# Altium schematic sheet DDR.SchDoc
size C; DocumentNumber: 5; SheetNumber: 5; SheetTotal: 8
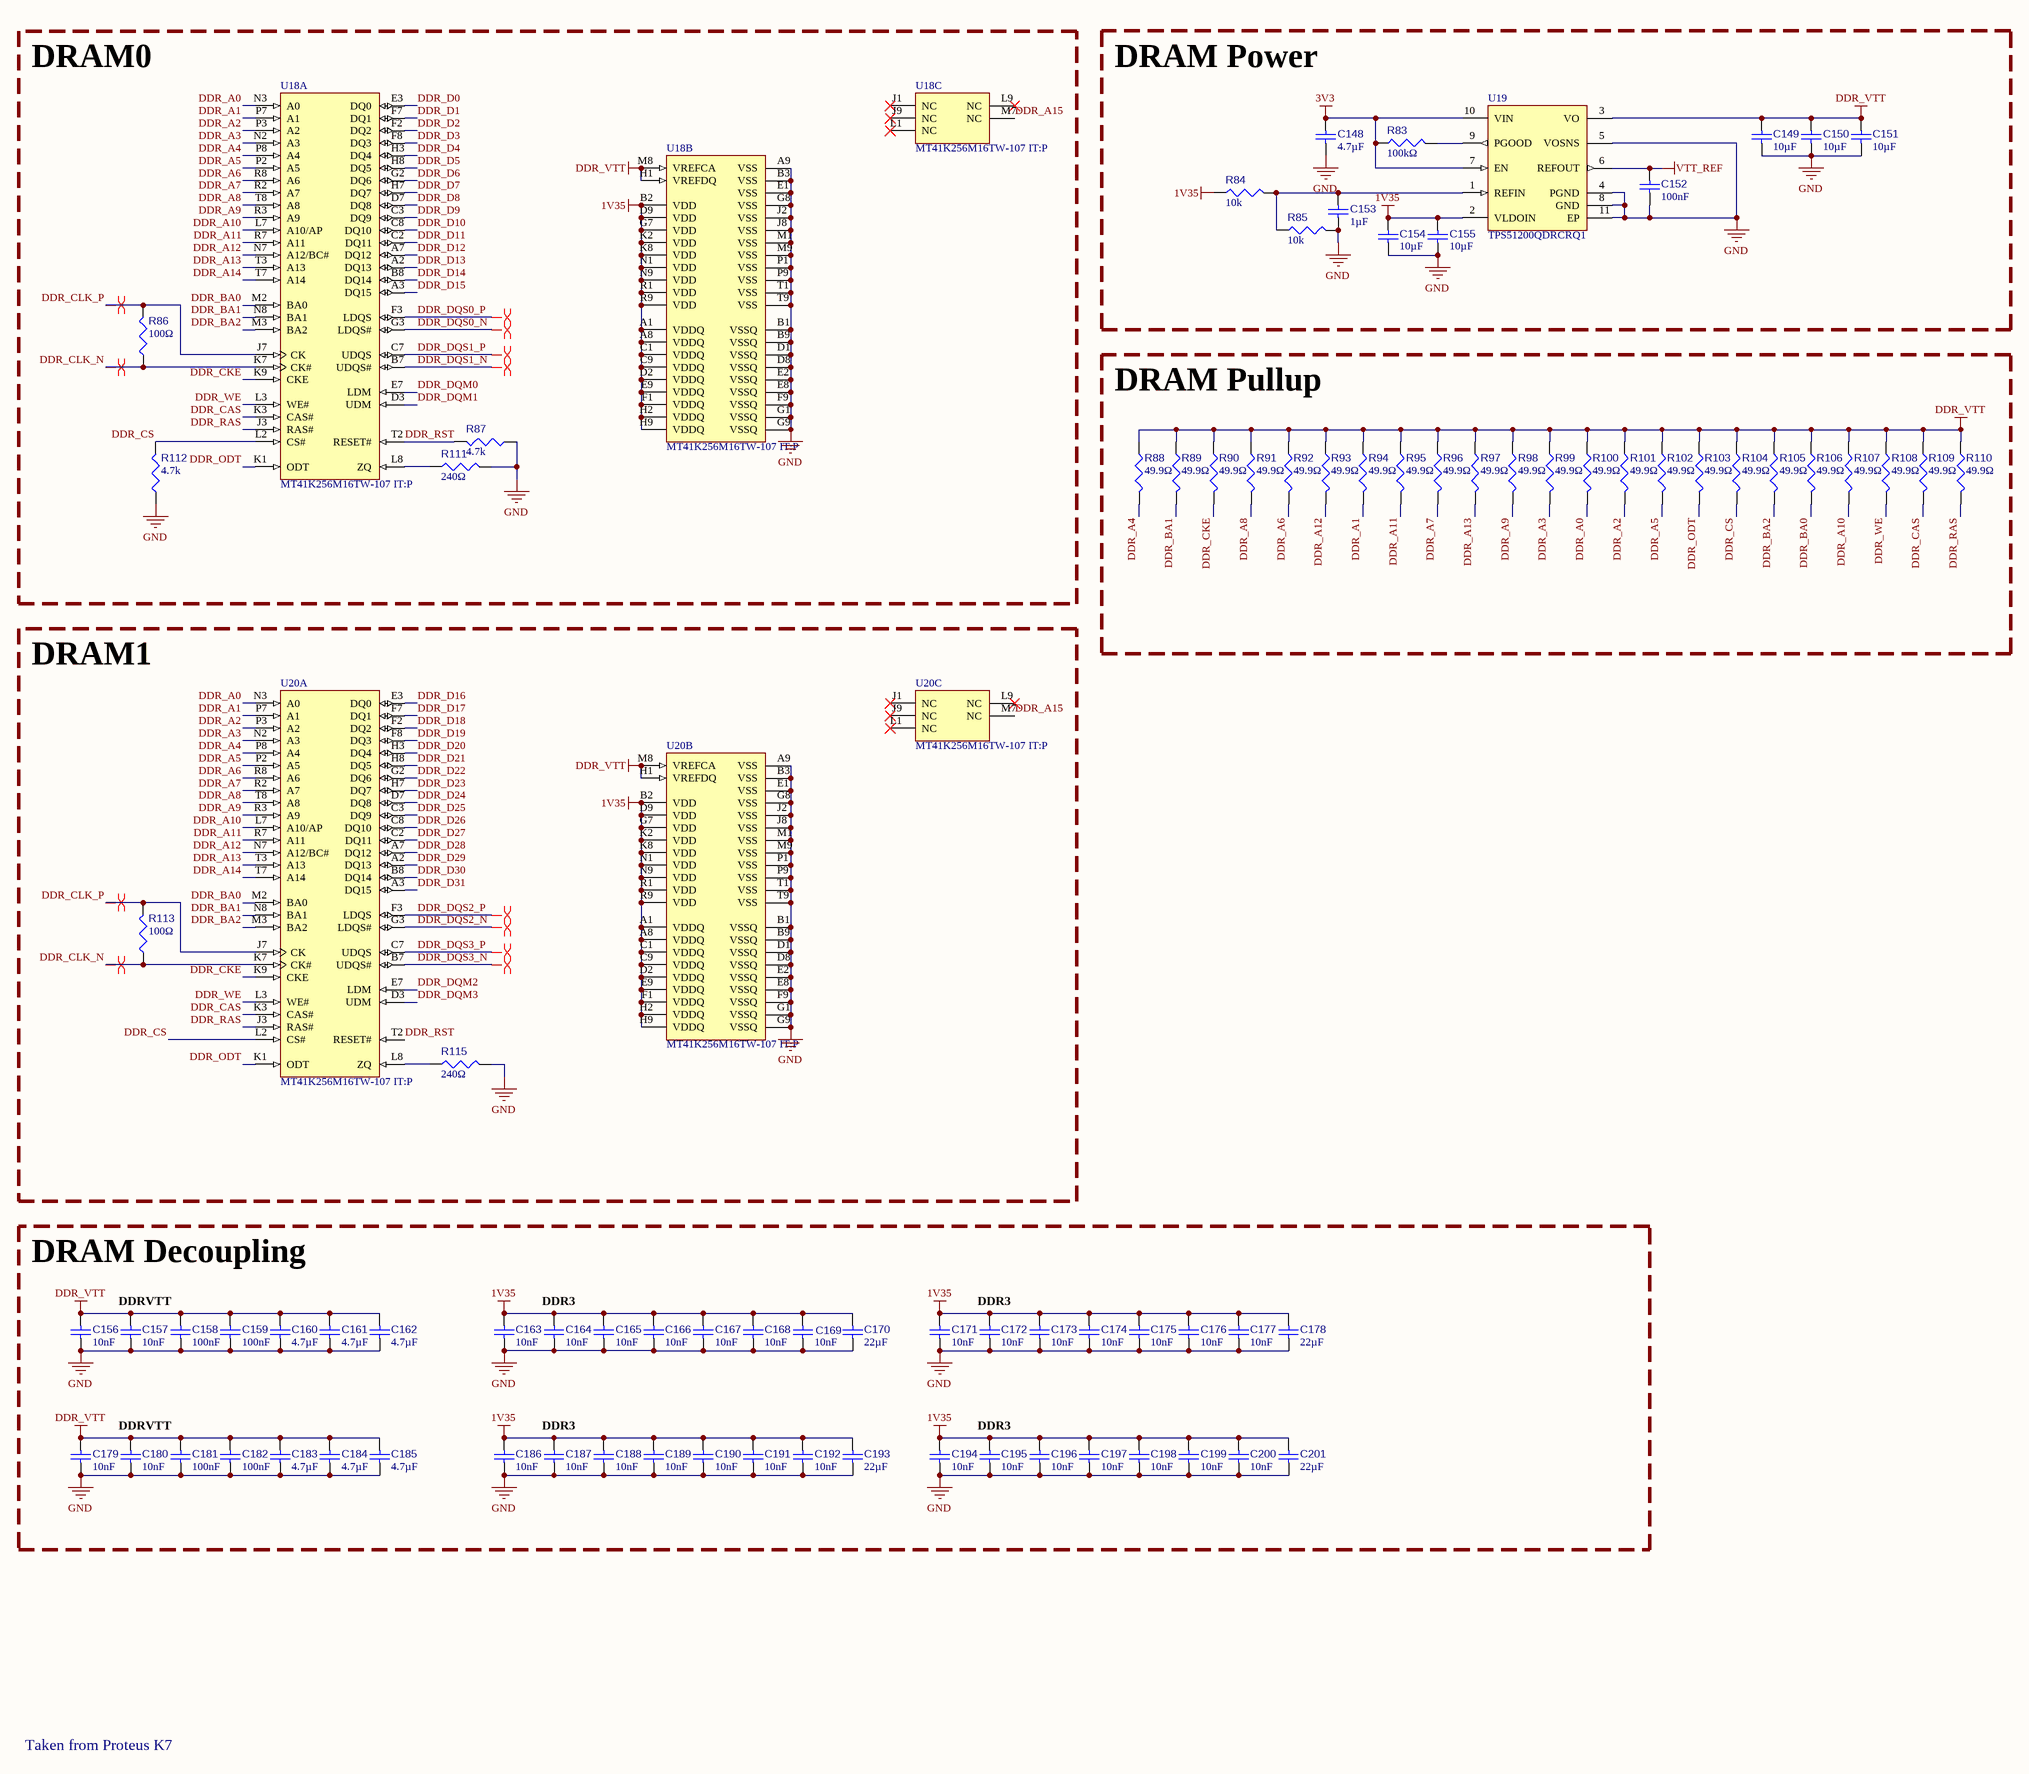
[diagram p0: DDR.SchDoc]

## Parts
C148  value 4.7µF  [CAP-0402-MFG]  (hidden comment: GRM155R61E475ME15D)
C149  value 10µF  [CAP-0603-MFG]  (hidden comment: GRT188R61C106KE13J)
C150  value 10µF  [CAP-0603-MFG]  (hidden comment: GRT188R61C106KE13J)
C151  value 10µF  [CAP-0603-MFG]  (hidden comment: GRT188R61C106KE13J)
C152  value 100nF  [CAP-0402-MFG]  (hidden comment: CL05B104KO5VPNC)
C153  value 1µF  [CAP-0402-MFG]  (hidden comment: GRT155C81C105KE13J)
C154  value 10µF  [CAP-0603-MFG]  (hidden comment: GRT188R61C106KE13J)
C155  value 10µF  [CAP-0603-MFG]  (hidden comment: GRT188R61C106KE13J)
C156  value 10nF  [CAP-0402-MFG]  (hidden comment: AC0402KRX7R7BB103)
C157  value 10nF  [CAP-0402-MFG]  (hidden comment: AC0402KRX7R7BB103)
C158  value 100nF  [CAP-0402-MFG]  (hidden comment: CL05B104KO5VPNC)
C159  value 100nF  [CAP-0402-MFG]  (hidden comment: CL05B104KO5VPNC)
C160  value 4.7µF  [CAP-0402-MFG]  (hidden comment: GRM155R61E475ME15D)
C161  value 4.7µF  [CAP-0402-MFG]  (hidden comment: GRM155R61E475ME15D)
C162  value 4.7µF  [CAP-0402-MFG]  (hidden comment: GRM155R61E475ME15D)
C163  value 10nF  [CAP-0402-MFG]  (hidden comment: AC0402KRX7R7BB103)
C164  value 10nF  [CAP-0402-MFG]  (hidden comment: AC0402KRX7R7BB103)
C165  value 10nF  [CAP-0402-MFG]  (hidden comment: AC0402KRX7R7BB103)
C166  value 10nF  [CAP-0402-MFG]  (hidden comment: AC0402KRX7R7BB103)
C167  value 10nF  [CAP-0402-MFG]  (hidden comment: AC0402KRX7R7BB103)
C168  value 10nF  [CAP-0402-MFG]  (hidden comment: AC0402KRX7R7BB103)
C169  value 10nF  [CAP-0402-MFG]  (hidden comment: AC0402KRX7R7BB103)
C170  value 22µF  [CAP-0402-MFG]  (hidden comment: GRM158R61A226ME15D)
C171  value 10nF  [CAP-0402-MFG]  (hidden comment: AC0402KRX7R7BB103)
C172  value 10nF  [CAP-0402-MFG]  (hidden comment: AC0402KRX7R7BB103)
C173  value 10nF  [CAP-0402-MFG]  (hidden comment: AC0402KRX7R7BB103)
C174  value 10nF  [CAP-0402-MFG]  (hidden comment: AC0402KRX7R7BB103)
C175  value 10nF  [CAP-0402-MFG]  (hidden comment: AC0402KRX7R7BB103)
C176  value 10nF  [CAP-0402-MFG]  (hidden comment: AC0402KRX7R7BB103)
C177  value 10nF  [CAP-0402-MFG]  (hidden comment: AC0402KRX7R7BB103)
C178  value 22µF  [CAP-0402-MFG]  (hidden comment: GRM158R61A226ME15D)
C179  value 10nF  [CAP-0402-MFG]  (hidden comment: AC0402KRX7R7BB103)
C180  value 10nF  [CAP-0402-MFG]  (hidden comment: AC0402KRX7R7BB103)
C181  value 100nF  [CAP-0402-MFG]  (hidden comment: CL05B104KO5VPNC)
C182  value 100nF  [CAP-0402-MFG]  (hidden comment: CL05B104KO5VPNC)
C183  value 4.7µF  [CAP-0402-MFG]  (hidden comment: GRM155R61E475ME15D)
C184  value 4.7µF  [CAP-0402-MFG]  (hidden comment: GRM155R61E475ME15D)
C185  value 4.7µF  [CAP-0402-MFG]  (hidden comment: GRM155R61E475ME15D)
C186  value 10nF  [CAP-0402-MFG]  (hidden comment: AC0402KRX7R7BB103)
C187  value 10nF  [CAP-0402-MFG]  (hidden comment: AC0402KRX7R7BB103)
C188  value 10nF  [CAP-0402-MFG]  (hidden comment: AC0402KRX7R7BB103)
C189  value 10nF  [CAP-0402-MFG]  (hidden comment: AC0402KRX7R7BB103)
C190  value 10nF  [CAP-0402-MFG]  (hidden comment: AC0402KRX7R7BB103)
C191  value 10nF  [CAP-0402-MFG]  (hidden comment: AC0402KRX7R7BB103)
C192  value 10nF  [CAP-0402-MFG]  (hidden comment: AC0402KRX7R7BB103)
C193  value 22µF  [CAP-0402-MFG]  (hidden comment: GRM158R61A226ME15D)
C194  value 10nF  [CAP-0402-MFG]  (hidden comment: AC0402KRX7R7BB103)
C195  value 10nF  [CAP-0402-MFG]  (hidden comment: AC0402KRX7R7BB103)
C196  value 10nF  [CAP-0402-MFG]  (hidden comment: AC0402KRX7R7BB103)
C197  value 10nF  [CAP-0402-MFG]  (hidden comment: AC0402KRX7R7BB103)
C198  value 10nF  [CAP-0402-MFG]  (hidden comment: AC0402KRX7R7BB103)
C199  value 10nF  [CAP-0402-MFG]  (hidden comment: AC0402KRX7R7BB103)
C200  value 10nF  [CAP-0402-MFG]  (hidden comment: AC0402KRX7R7BB103)
C201  value 22µF  [CAP-0402-MFG]  (hidden comment: GRM158R61A226ME15D)
R83  value 100kΩ  [RES-0402]  (hidden comment: AC0402FR-07100KL)
R84  value 10k  [RES-0402]  (hidden comment: AC0402FR-0710KL)
R85  value 10k  [RES-0402]  (hidden comment: AC0402FR-0710KL)
R86  value 100Ω  [RES-0402]  (hidden comment: AC0402FR-07100RL)
R87  value 4.7k  [RES-0402]  (hidden comment: AC0402FR-074K7L)
R88  value 49.9Ω  [RES-0402]  (hidden comment: CRCW040249R9FKED)
R89  value 49.9Ω  [RES-0402]  (hidden comment: CRCW040249R9FKED)
R90  value 49.9Ω  [RES-0402]  (hidden comment: CRCW040249R9FKED)
R91  value 49.9Ω  [RES-0402]  (hidden comment: CRCW040249R9FKED)
R92  value 49.9Ω  [RES-0402]  (hidden comment: CRCW040249R9FKED)
R93  value 49.9Ω  [RES-0402]  (hidden comment: CRCW040249R9FKED)
R94  value 49.9Ω  [RES-0402]  (hidden comment: CRCW040249R9FKED)
R95  value 49.9Ω  [RES-0402]  (hidden comment: CRCW040249R9FKED)
R96  value 49.9Ω  [RES-0402]  (hidden comment: CRCW040249R9FKED)
R97  value 49.9Ω  [RES-0402]  (hidden comment: CRCW040249R9FKED)
R98  value 49.9Ω  [RES-0402]  (hidden comment: CRCW040249R9FKED)
R99  value 49.9Ω  [RES-0402]  (hidden comment: CRCW040249R9FKED)
R100  value 49.9Ω  [RES-0402]  (hidden comment: CRCW040249R9FKED)
R101  value 49.9Ω  [RES-0402]  (hidden comment: CRCW040249R9FKED)
R102  value 49.9Ω  [RES-0402]  (hidden comment: CRCW040249R9FKED)
R103  value 49.9Ω  [RES-0402]  (hidden comment: CRCW040249R9FKED)
R104  value 49.9Ω  [RES-0402]  (hidden comment: CRCW040249R9FKED)
R105  value 49.9Ω  [RES-0402]  (hidden comment: CRCW040249R9FKED)
R106  value 49.9Ω  [RES-0402]  (hidden comment: CRCW040249R9FKED)
R107  value 49.9Ω  [RES-0402]  (hidden comment: CRCW040249R9FKED)
R108  value 49.9Ω  [RES-0402]  (hidden comment: CRCW040249R9FKED)
R109  value 49.9Ω  [RES-0402]  (hidden comment: CRCW040249R9FKED)
R110  value 49.9Ω  [RES-0402]  (hidden comment: CRCW040249R9FKED)
R111  value 240Ω  [RES-0402]  (hidden comment: AC0402FR-07240RL)
R112  value 4.7k  [RES-0402]  (hidden comment: AC0402FR-074K7L)
R113  value 100Ω  [RES-0402]  (hidden comment: AC0402FR-07100RL)
R115  value 240Ω  [RES-0402]  (hidden comment: AC0402FR-07240RL)
U18  MT41K256M16TW-107 IT:P  [MICT-TW-96]  (parts A,B,C of 3)
U19  TPS51200QDRCRQ1  [FP-DRC0010J-MFG]
U20  MT41K256M16TW-107 IT:P  [MICT-TW-96]  (parts A,B,C of 3)

## Blocks framed on the sheet
DRAM0: R86 R87 R111 R112 U18
DRAM Power: C148-C155 R83-R85 U19
DRAM Pullup: R88-R110
DRAM1: R113 R115 U20
DRAM Decoupling: C156-C201

## Nets
1V35: C154.1 C155.1 C163.1 C164.1 C165.1 C166.1 C167.1 C168.2 C169.1 C170.1 C171.1 C172.2 C173.2 C174.2 C175.2 C176.2 C177.2 C178.1 C186.1 C187.2 C188.2 C189.2 C190.2 C191.2 C192.2 C193.1 C194.1 C195.2 C196.2 C197.2 C198.2 C199.2 C200.2 C201.1 R84.1 U18.A1(VDDQ) U18.A8(VDDQ) U18.B2(VDD) U18.C1(VDDQ) U18.C9(VDDQ) U18.D2(VDDQ) U18.D9(VDD) U18.E9(VDDQ) U18.F1(VDDQ) U18.G7(VDD) U18.H2(VDDQ) U18.H9(VDDQ) U18.K2(VDD) U18.K8(VDD) U18.N1(VDD) U18.N9(VDD) U18.R1(VDD) U18.R9(VDD) U19.2(VLDOIN) U20.A1(VDDQ) U20.A8(VDDQ) U20.B2(VDD) U20.C1(VDDQ) U20.C9(VDDQ) U20.D2(VDDQ) U20.D9(VDD) U20.E9(VDDQ) U20.F1(VDDQ) U20.G7(VDD) U20.H2(VDDQ) U20.H9(VDDQ) U20.K2(VDD) U20.K8(VDD) U20.N1(VDD) U20.N9(VDD) U20.R1(VDD) U20.R9(VDD)
3V3: C148.1 R83.1 U19.7(EN) U19.10(VIN)
DDR_VTT: C149.1 C150.1 C151.2 C156.1 C157.1 C158.2 C159.2 C160.1 C161.1 C162.2 C179.1 C180.1 C181.1 C182.1 C183.1 C184.1 C185.2 R88.1 R89.1 R90.1 R91.1 R92.1 R93.1 R94.1 R95.1 R96.1 R97.1 R98.1 R99.1 R100.1 R101.1 R102.1 R103.1 R104.1 R105.1 R106.1 R107.1 R108.1 R109.1 R110.1 U18.H1(VREFDQ) U18.M8(VREFCA) U19.3(VO) U20.H1(VREFDQ) U20.M8(VREFCA)
GND: C148.2 C149.2 C150.2 C151.1 C152.2 C153.1 C154.2 C155.2 C156.2 C157.2 C158.1 C159.1 C160.2 C161.2 C162.1 C163.2 C164.2 C165.2 C166.2 C167.2 C168.1 C169.2 C170.2 C171.2 C172.1 C173.1 C174.1 C175.1 C176.1 C177.1 C178.2 C179.2 C180.2 C181.2 C182.2 C183.2 C184.2 C185.1 C186.2 C187.1 C188.1 C189.1 C190.1 C191.1 C192.1 C193.2 C194.2 C195.1 C196.1 C197.1 C198.1 C199.1 C200.1 C201.2 R85.2 R87.1 R111.2 R112.1 R115.2 U18.A9(VSS) U18.B1(VSSQ) U18.B3(VSS) U18.B9(VSSQ) U18.D1(VSSQ) U18.D8(VSSQ) U18.E1(VSS) U18.E2(VSSQ) U18.E8(VSSQ) U18.F9(VSSQ) U18.G1(VSSQ) U18.G8(VSS) U18.G9(VSSQ) U18.J2(VSS) U18.J8(VSS) U18.M1(VSS) U18.M9(VSS) U18.P1(VSS) U18.P9(VSS) U18.T1(VSS) U18.T9(VSS) U19.4(PGND) U19.5(VOSNS) U19.8(GND) U19.11(EP) U20.A9(VSS) U20.B1(VSSQ) U20.B3(VSS) U20.B9(VSSQ) U20.D1(VSSQ) U20.D8(VSSQ) U20.E1(VSS) U20.E2(VSSQ) U20.E8(VSSQ) U20.F9(VSSQ) U20.G1(VSSQ) U20.G8(VSS) U20.G9(VSSQ) U20.J2(VSS) U20.J8(VSS) U20.M1(VSS) U20.M9(VSS) U20.P1(VSS) U20.P9(VSS) U20.T1(VSS) U20.T9(VSS)
VTT_REF: C152.1 U19.6(REFOUT)
DDR_A0: R100.2 U18.N3(A0) U20.N3(A0)
DDR_A1: R94.2 U18.P7(A1) U20.P7(A1)
DDR_A2: R101.2 U18.P3(A2) U20.P3(A2)
DDR_A3: R99.2 U18.N2(A3) U20.N2(A3)
DDR_A4: R88.2 U18.P8(A4) U20.P8(A4)
DDR_A5: R102.2 U18.P2(A5) U20.P2(A5)
DDR_A6: R92.2 U18.R8(A6) U20.R8(A6)
DDR_A7: R96.2 U18.R2(A7) U20.R2(A7)
DDR_A8: R91.2 U18.T8(A8) U20.T8(A8)
DDR_A9: R98.2 U18.R3(A9) U20.R3(A9)
DDR_A10: R107.2 U18.L7(A10/AP) U20.L7(A10/AP)
DDR_A11: R95.2 U18.R7(A11) U20.R7(A11)
DDR_A12: R93.2 U18.N7(A12/BC#) U20.N7(A12/BC#)
DDR_A13: R97.2 U18.T3(A13) U20.T3(A13)
DDR_A14: U18.T7(A14) U20.T7(A14)
DDR_A15: U18.M7(NC) U20.M7(NC)
DDR_BA0: R106.2 U18.M2(BA0) U20.M2(BA0)
DDR_BA1: R89.2 U18.N8(BA1) U20.N8(BA1)
DDR_BA2: R105.2 U18.M3(BA2) U20.M3(BA2)
DDR_CAS: R109.2 U18.K3(CAS#) U20.K3(CAS#)
DDR_CKE: R90.2 U18.K9(CKE) U20.K9(CKE)
DDR_CLK_N: R86.1 R113.1 U18.K7(CK#) U20.K7(CK#)
DDR_CLK_P: R86.2 R113.2 U18.J7(CK) U20.J7(CK)
DDR_CS: R104.2 R112.2 U18.L2(CS#) U20.L2(CS#)
DDR_D0: U18.E3(DQ0)
DDR_D1: U18.F7(DQ1)
DDR_D2: U18.F2(DQ2)
DDR_D3: U18.F8(DQ3)
DDR_D4: U18.H3(DQ4)
DDR_D5: U18.H8(DQ5)
DDR_D6: U18.G2(DQ6)
DDR_D7: U18.H7(DQ7)
DDR_D8: U18.D7(DQ8)
DDR_D9: U18.C3(DQ9)
DDR_D10: U18.C8(DQ10)
DDR_D11: U18.C2(DQ11)
DDR_D12: U18.A7(DQ12)
DDR_D13: U18.A2(DQ13)
DDR_D14: U18.B8(DQ14)
DDR_D15: U18.A3(DQ15)
DDR_D16: U20.E3(DQ0)
DDR_D17: U20.F7(DQ1)
DDR_D18: U20.F2(DQ2)
DDR_D19: U20.F8(DQ3)
DDR_D20: U20.H3(DQ4)
DDR_D21: U20.H8(DQ5)
DDR_D22: U20.G2(DQ6)
DDR_D23: U20.H7(DQ7)
DDR_D24: U20.D7(DQ8)
DDR_D25: U20.C3(DQ9)
DDR_D26: U20.C8(DQ10)
DDR_D27: U20.C2(DQ11)
DDR_D28: U20.A7(DQ12)
DDR_D29: U20.A2(DQ13)
DDR_D30: U20.B8(DQ14)
DDR_D31: U20.A3(DQ15)
DDR_DQM0: U18.E7(LDM)
DDR_DQM1: U18.D3(UDM)
DDR_DQM2: U20.E7(LDM)
DDR_DQM3: U20.D3(UDM)
DDR_DQS0_N: U18.G3(LDQS#)
DDR_DQS0_P: U18.F3(LDQS)
DDR_DQS1_N: U18.B7(UDQS#)
DDR_DQS1_P: U18.C7(UDQS)
DDR_DQS2_N: U20.G3(LDQS#)
DDR_DQS2_P: U20.F3(LDQS)
DDR_DQS3_N: U20.B7(UDQS#)
DDR_DQS3_P: U20.C7(UDQS)
DDR_ODT: R103.2 U18.K1(ODT) U20.K1(ODT)
DDR_RAS: R110.2 U18.J3(RAS#) U20.J3(RAS#)
DDR_RST: R87.2 U18.T2(RESET#) U20.T2(RESET#)
DDR_WE: R108.2 U18.L3(WE#) U20.L3(WE#)
NetC153_2: C153.2 R84.2 R85.1 U19.1(REFIN)
NetR83_2: R83.2 U19.9(PGOOD)
NetR111_1: R111.1 U18.L8(ZQ)
NetR115_1: R115.1 U20.L8(ZQ)

Not connected (* = marked no-connect by the designer): U18 J1(NC)* J9(NC)* L1(NC)* L9(NC)*; U20 J1(NC)* J9(NC)* L1(NC)* L9(NC)*

## Layout directives
differential pair: DDR_CLK_N, DDR_CLK_P, DDR_DQS0_N, DDR_DQS1_N, DDR_DQS1_P, DDR_DQS2_N, DDR_DQS3_N, DDR_DQS3_P
differential pair; differential pair class DDR: DDR_DQS0_P, DDR_DQS2_P

## Notes on the sheet
- (near C157) DDRVTT
- (near C164) DDR3
- (near C172) DDR3
- (near C180) DDRVTT
- (near C187) DDR3
- (near C195) DDR3
- Taken from Proteus K7

## Library data of the parts
C148 C160-C162 C183-C185 = CMP-104-000119-5: 0402-4.7u-20%-25V-X5R; Manufacturer Name: Murata; Temp Code: X5R; Tolerance: 20%; Capacitor Type: Ceramic; Voltage Rating: 25V; Pin Count: 2; Case/Package: 0402; Mounting Technology: Surface Mount; Source: Components - 11.02.26 - 17.26.SchLib; JLC PN: C2858031; Min Operating Temperature: -55°C; Max Operating Temperature: 85°C; Design Item ID: CMP-001-00116-4; Component Type: Standard; Info: 0402-4.7u-20%-25V-X5R; Pins: 2; Manufacturer Part Number: GRM155R61E475ME15D
C149-C151 C154 C155 = CMP-104-000103-5: 0603-10u-10%-16V-X5R-AECQ200; Manufacturer Name: Murata; Tolerance: 10%; Voltage Rating: 16V; Capacitor Type: Ceramic; Design Item ID: CMP-001-00130-1; Min Operating Temperature: -55°C; Source: Components - 11.02.26 - 17.26.SchLib; Info: 0603-10u-10%-16V-X5R-AECQ200; Mounting Technology: Surface Mount; Pin Count: 2; Pins: 2; Manufacturer Part Number: GRT188R61C106KE13J; Max Operating Temperature: 85°C; Component Type: Standard; Case/Package: 0603; JLC PN: C3888097
C152 C158 C159 C181 C182 = CMP-104-000086-6: 0402-100n-10%-16V-X7R-AECQ200; Manufacturer Name: Murata; Capacitor Type: Ceramic; Voltage Rating: 16V; Tolerance: 10%; Temp Code: X7R; Component Type: Standard; Min Operating Temperature: -55°C; Source: Components - 11.02.26 - 17.26.SchLib; Design Item ID: CMP-001-00111-7; Pin Count: 2; Max Operating Temperature: 125°C; Case/Package: 0402; Pins: 2; Info: 0402-100n-10%-16V-X7R-AECQ200; Manufacturer Part Number: CL05B104KO5VPNC; Mounting Technology: Surface Mount; JLC PN: C307332
C153 = CMP-104-000087-6: 0402-1u-10%-16V-X6S-AECQ200; Manufacturer Name: Murata; Temp Code: X6S; Voltage Rating: 16V; Capacitor Type: Ceramic; Tolerance: 10%; Min Operating Temperature: -55°C; Pin Count: 2; Design Item ID: CMP-001-00112-5; Manufacturer Part Number: GRT155C81C105KE13J; Info: 0402-1u-10%-16V-X6S-AECQ200; Mounting Technology: Surface Mount; Component Type: Standard; Case/Package: 0402; Source: Components - 11.02.26 - 17.26.SchLib; Max Operating Temperature: 105°C; Pins: 2; JLC PN: C908010
C156 C157 C163-C169 C171-C177 C179 C180 C186-C192 C194-C200 = CMP-104-000090-6: 0402-10n-10%-16V-X7R-AECQ200; Manufacturer Name: YAGEO; Capacitor Type: Ceramic; Temp Code: X7R; Tolerance: 10%; Voltage Rating: 16V; Design Item ID: CMP-001-00115-5; Mounting Technology: Surface Mount; Case/Package: 0402; Pins: 2; Manufacturer Part Number: AC0402KRX7R7BB103; Min Operating Temperature: -55°C; Info: 0402-10n-10%-16V-X7R-AECQ200; Pin Count: 2; Max Operating Temperature: 125°C; Component Type: Standard; Source: Components - 11.02.26 - 17.26.SchLib; JLC PN: C726515
C170 C178 C193 C201 = CMP-104-000116-5: 0402-22u-20%-10V-X5R; Manufacturer Name: Murata; Capacitor Type: Ceramic; Temp Code: X5R; Tolerance: 20%; Voltage Rating: 10V; Max Operating Temperature: 85°C; Source: Components - 11.02.26 - 17.26.SchLib; Mounting Technology: Surface Mount; Pins: 2; Design Item ID: CMP-001-00111-7; Case/Package: 0402; Info: 0402-22u-20%-10V-X5R; JLC PN: C3845593; Pin Count: 2; Min Operating Temperature: -55°C; Component Type: Standard; Manufacturer Part Number: GRM158R61A226ME15D
R83 = CMP-014-000103-4: 0402-100k-1%-1/16W-AEC-Q200; Manufacturer Name: YAGEO; Tolerance: 1%; Voltage Rating: 50V; Power: 63mW; Min Operating Temperature: -55°C; Pin Count: 2; Component Type: Standard; Manufacturer Part Number: AC0402FR-07100KL; Design Item ID: CMP-009-00205-1; Source: Components - 11.02.26 - 17.27.SchLib; Mounting Technology: Surface Mount; Case/Package: 0402; Pins: 2; Info: 0402-100k-1%-1/16W-AEC-Q200; Max Operating Temperature: 155°C; JLC PN: C144809
R84 R85 = CMP-014-000077-5: 0402-10k-1%-1/16W-AEC-Q200; Manufacturer Name: YAGEO; Tolerance: 1%; Voltage Rating: 50V; Power: 63mW; Pins: 2; Source: Components - 11.02.26 - 17.27.SchLib; Manufacturer Part Number: AC0402FR-0710KL; Info: 0402-10k-1%-1/16W-AEC-Q200; Min Operating Temperature: -55°C; Pin Count: 2; Case/Package: 0402; Design Item ID: CMP-009-00191-3; Max Operating Temperature: 155°C; Component Type: Standard; Mounting Technology: Surface Mount; JLC PN: C144807
R86 R113 = CMP-014-000108-4: 0402-100-1%-1/16W-AEC-Q200; Manufacturer Name: YAGEO; Voltage Rating: 50V; Power: 63mW; Tolerance: 1%; Case/Package: 0402; Manufacturer Part Number: AC0402FR-07100RL; Mounting Technology: Surface Mount; Pin Count: 2; Component Type: Standard; Max Operating Temperature: 155°C; Pins: 2; Design Item ID: CMP-009-00202-1; Min Operating Temperature: -55°C; Source: Components - 11.02.26 - 17.27.SchLib; Info: 0402-100-1%-1/16W-AEC-Q200; JLC PN: C144808
R87 R112 = CMP-014-000082-5: 0402-4.7k-1%-1/16W-AEC-Q200; Manufacturer Name: YAGEO; Tolerance: 1%; Power: 63mW; Voltage Rating: 50V; Component Type: Standard; Source: Components - 11.02.26 - 17.27.SchLib; Min Operating Temperature: -55°C; Mounting Technology: Surface Mount; Design Item ID: CMP-009-00196-1; Manufacturer Part Number: AC0402FR-074K7L; Max Operating Temperature: 155°C; Pins: 2; Case/Package: 0402; Pin Count: 2; Info: 0402-4.7k-1%-1/16W-AEC-Q200; JLC PN: C174364
R88-R110 = CMP-014-000125-4: 0402-49.9-1%-1/16W-AEC-Q200; Manufacturer Name: Vishay; Tolerance: 1%; Voltage Rating: 50V; Power: 63mW; Manufacturer Part Number: CRCW040249R9FKED; Case/Package: 0402; Design Item ID: CMP-009-00210-1; Source: Components - 11.02.26 - 17.27.SchLib; Pins: 2; Max Operating Temperature: 155°C; Min Operating Temperature: -55°C; Info: 0402-49.9-1%-1/16W-AEC-Q200; Mounting Technology: Surface Mount; JLC PN: C482189
R111 R115 = CMP-014-000124-4: 0402-240-1%-1/16W-AEC-Q200; Manufacturer Name: YAGEO; Power: 63mW; Voltage Rating: 50V; Tolerance: 1%; Info: 0402-240-1%-1/16W-AEC-Q200; Pins: 2; Max Operating Temperature: 155°C; Manufacturer Part Number: AC0402FR-07240RL; Mounting Technology: Surface Mount; Source: Components - 11.02.26 - 17.27.SchLib; Min Operating Temperature: -55°C; Case/Package: 0402; Design Item ID: CMP-009-00199-1; JLC PN: C144776
U18 U20 = CMP-051-000051-2: IC DRAM 4GBIT PAR 96FBGA SDRAM - DDR3L Memory IC 4Gbit Parallel 933 MHz 20 ns 96-FBGA (8x14); Manufacturer Name: Micron; Data Bus Width: 16b; Address Bus Width: 15b; Operating Supply Voltage: 1.35V; Max Supply Voltage: 1.45V; Clock Frequency: 933MHz; Min Supply Voltage: 1.283V; Max Operating Temperature: 95°C; Min Operating Temperature: -40°C; Mounting Technology: Surface Mount; JLC PN: C367428; Pins: 96; Case/Package: BGA; Terminal Pitch: 800µm; Manufacturer Part Number: MT41K256M16TW-107 IT:P
U19 = CMP-051-000049-2: DDR/DDR2/DDR3/DDR3L/LPDDR3/DDR4 Termination Regulator 3A 2.375V to 3.5V 10-Pin VSON T/R; Manufacturer Name: Texas Instruments; Reference Voltage: 1.8V; Min Input Voltage: 2.3V; Nominal Output Voltage: 1.25V; Output Type: Fixed; Power Dissipation: 1.92W; Max Operating Temperature: 125°C; Min Supply Voltage: 2.375V; Output Current: 3A; Max Supply Voltage: 3.5V; Min Operating Temperature: -40°C; Pins: 10; JLC PN: C2991161; Manufacturer Part Number: TPS51200QDRCRQ1